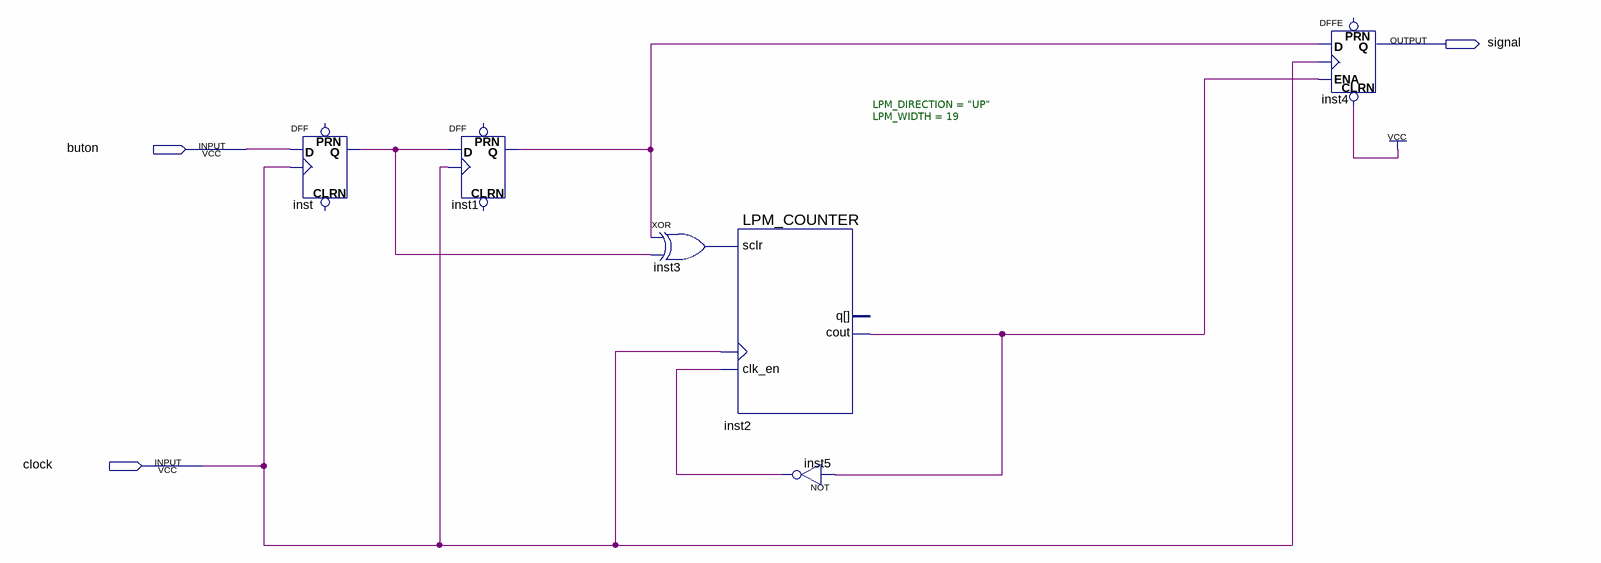
[diagram p0: schematic sheet]
// Quartus schematic debaunce.bdf as structural Verilog: 6 symbols, 3 pins
module debaunce (
  input  buton,
  input  clock,
  output signal
);

  wire inst1_q, inst2_cout, inst3_out, inst5_out, inst_q;

  DFF inst (.CLK(clock), .D(buton), .Q(inst_q));  // open: CLRN, PRN
  DFF inst1 (.CLK(clock), .D(inst_q), .Q(inst1_q));  // open: CLRN, PRN
  xor inst3 (inst3_out, inst1_q, inst_q);
  LPM_COUNTER #(.LPM_DIRECTION("UP"), .LPM_WIDTH(19)) inst2 (
    .clk_en(inst5_out), .clock(clock), .sclr(inst3_out), .cout(inst2_cout));  // open: q
  not inst5 (inst5_out, inst2_cout);
  DFFE inst4 (.CLRN(1'b1), .D(inst1_q), .CLK(clock), .ENA(inst2_cout), .Q(signal));  // open: PRN
endmodule
